# Altium schematic sheet OSCILLAR_HFB_V1p0_HFFILTB.SchDoc
size A4; SheetNumber: 7; SheetTotal: 12; Title_: High freq. Filter Bank
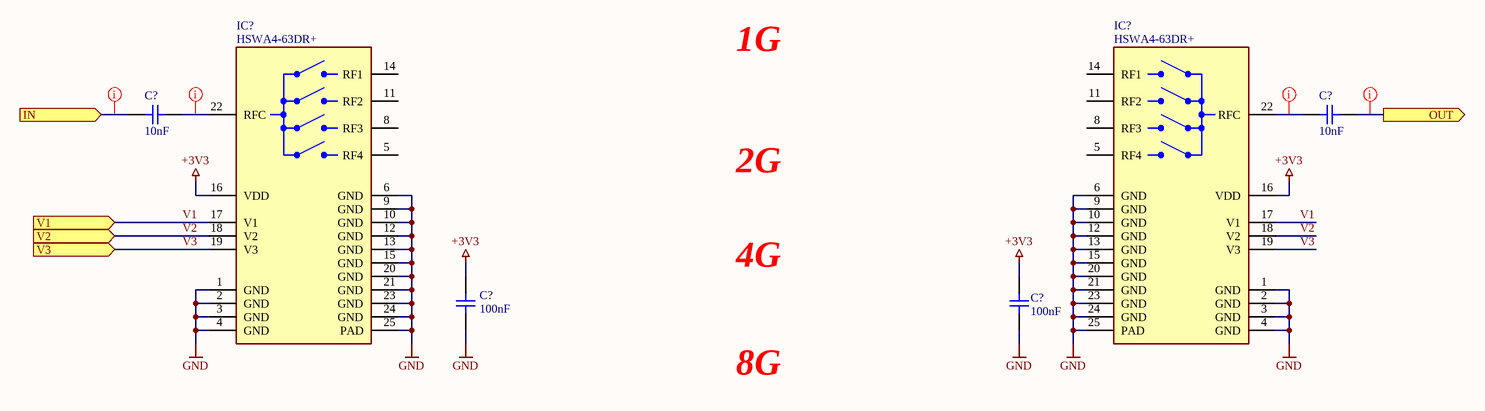
[diagram p0: OSCILLAR_HFB_V1p0_HFFILTB.SchDoc]

## Parts
(Parts that share a designator on the sheet are numbered #1, #2 ... from top to bottom, then left to right.)
C?#1  10nF  [CAP_0603]
C?#2  10nF  [CAP_0603]
C?#3  100nF  [CAP_0603]
C?#4  100nF  [CAP_0603]
IC?#1  HSWA4-63DR+  [DG984-1]
IC?#2  HSWA4-63DR+  [DG984-1]

## Ports
IN (in, see OSCILLAR_HFB_V1p0_MAIN), OUT (out, see OSCILLAR_HFB_V1p0_MAIN), V1 (in), V2 (in), V3 (in)

## Nets
+3V3: C?#3.2 C?#4.2 IC?#1.16(VDD) IC?#2.16(VDD)
GND: C?#3.1 C?#4.1 IC?#1.1(GND) IC?#1.2(GND) IC?#1.3(GND) IC?#1.4(GND) IC?#1.6(GND) IC?#1.9(GND) IC?#1.10(GND) IC?#1.12(GND) IC?#1.13(GND) IC?#1.15(GND) IC?#1.20(GND) IC?#1.21(GND) IC?#1.23(GND) IC?#1.24(GND) IC?#1.25(PAD) IC?#2.1(GND) IC?#2.2(GND) IC?#2.3(GND) IC?#2.4(GND) IC?#2.6(GND) IC?#2.9(GND) IC?#2.10(GND) IC?#2.12(GND) IC?#2.13(GND) IC?#2.15(GND) IC?#2.20(GND) IC?#2.21(GND) IC?#2.23(GND) IC?#2.24(GND) IC?#2.25(PAD)
IN: C?#1.2 ; port IN
OUT: C?#2.2 ; port OUT
V1: IC?#1.17(V1) IC?#2.17(V1) ; port V1
V2: IC?#1.18(V2) IC?#2.18(V2) ; port V2
V3: IC?#1.19(V3) IC?#2.19(V3) ; port V3
NetC?#1_1: C?#1.1 IC?#1.22(RFC)
NetC?#2_1: C?#2.1 IC?#2.22(RFC)

Not connected (* = marked no-connect by the designer): IC?#1 5(RF4) 8(RF3) 11(RF2) 14(RF1); IC?#2 5(RF4) 8(RF3) 11(RF2) 14(RF1)

## Layout directives
net class 50R: IN, NetC?#1_1, NetC?#2_1, OUT

## Notes on the sheet
- 1G
- 2G
- 4G
- 8G
- Board:
- Author:
- Title:
- Project:
- SVN:
- Version:
- Sheet:
- of
- Contact:
- Modified:
- Size:
- A4

## Library data of the parts
C?#1-C?#4 = NP-CAPACITOR: MLCC capacitor; Type: CAP
IC?#1 IC?#2 = HSWA4-63DR+: RF Switch, SP4T, 30M-6GHz; Part number: 139-HSWA4-63DR; Supplier: Mouser; Type: IC; ComponentLink1Description: Datasheet; ComponentLink2Description: Order; ComponentLink2URL: https://hu.mouser.com/ProductDetail/Mini-Circuits/HSWA4-63DR%2b?qs=xZ%2FP%252Ba9zWqYOhYanAihSnw%3D%3D